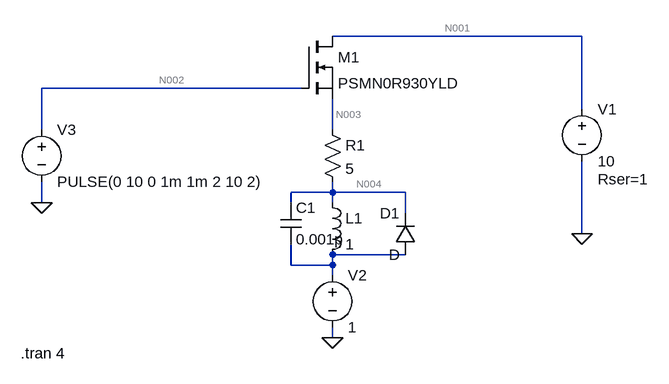
[diagram p0: schematic test.asc]
test.asc, the LTspice schematic file:
Version 4
SHEET 1 964 680
WIRE 848 -112 464 -112
WIRE 416 -32 16 -32
WIRE 848 0 848 -112
WIRE 16 32 16 -32
WIRE 464 32 464 -16
WIRE 464 128 464 112
WIRE 464 128 400 128
WIRE 576 128 464 128
WIRE 16 144 16 112
WIRE 400 144 400 128
WIRE 464 144 464 128
WIRE 576 160 576 128
WIRE 848 192 848 80
WIRE 576 224 464 224
WIRE 400 240 400 208
WIRE 464 240 464 224
WIRE 464 240 400 240
WIRE 464 256 464 240
WIRE 464 352 464 336
FLAG 848 192 0
FLAG 464 352 0
FLAG 16 144 0
SYMBOL voltage 848 -16 R0
WINDOW 123 0 0 Left 2
WINDOW 39 24 124 Left 2
SYMATTR SpiceLine Rser=1
SYMATTR InstName V1
SYMATTR Value 10
SYMBOL res 448 16 R0
SYMATTR InstName R1
SYMATTR Value 5
SYMBOL ind 448 128 R0
SYMATTR InstName L1
SYMATTR Value 1
SYMBOL nmos 416 -112 R0
SYMATTR InstName M1
SYMATTR Value PSMN0R930YLD
SYMBOL voltage 464 240 R0
WINDOW 123 0 0 Left 2
WINDOW 39 0 0 Left 2
SYMATTR InstName V2
SYMATTR Value 1
SYMBOL voltage 16 16 R0
WINDOW 123 0 0 Left 2
WINDOW 39 0 0 Left 2
SYMATTR InstName V3
SYMATTR Value PULSE(0 10 0 1m 1m 2 10 2)
SYMBOL cap 384 144 R0
SYMATTR InstName C1
SYMATTR Value 0.001p
SYMBOL diode 592 224 R180
WINDOW 0 24 64 Left 2
WINDOW 3 24 0 Left 2
SYMATTR InstName D1
TEXT -16 376 Left 2 !.tran 4

The netlist it stands for:
* test.asc
V1 N001 0 10 Rser=1
R1 N003 N004 5
L1 N004 N005 1
M1 N001 N002 N003 N003 PSMN0R930YLD
V2 N005 0 1
V3 N002 0 PULSE(0 10 0 1m 1m 2 10 2)
C1 N004 N005 0.001p
D1 N005 N004 D
.model D D
.lib standard.dio
.model NMOS NMOS
.model PMOS PMOS
.lib standard.mos
.tran 4
.backanno
.end

* Results of the author's LTspice run, read from the files saved beside the schematic
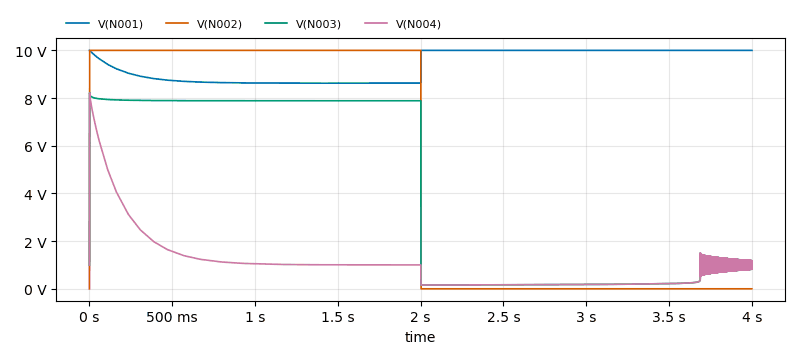
[diagram p1: Transient Analysis of test.asc, plotted from the saved traces]
* Transient Analysis, 1 run:
*   V(N001): min 8.623 V, max 10 V, average 9.38 V, rms 9.402 V, last 10 V
*   V(N002): min 0 V, max 10 V, average 5.003 V, rms 7.072 V, last 0 V
*   V(N003): min 157.6 mV, max 8.224 V, average 4.106 V, rms 5.593 V, last 957.6 mV
*   V(N004): min 158 mV, max 8.21 V, average 1.005 V, rms 1.587 V, last 957.5 mV